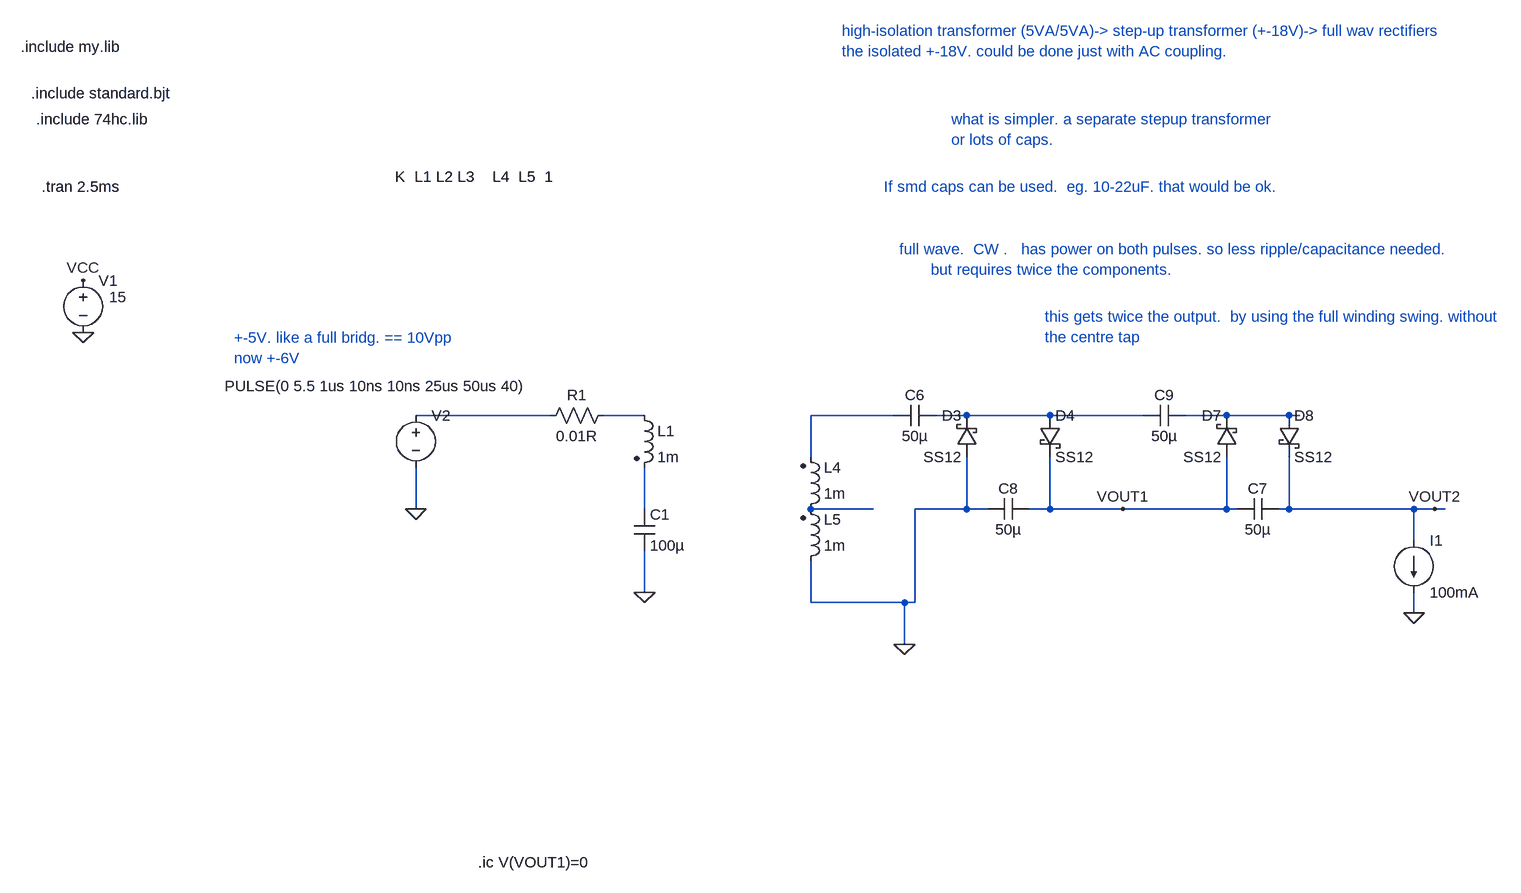
[diagram p0: schematic Draft105.asc]
Draft105.asc, the LTspice schematic file:
Version 4
SHEET 1 5720 1740
WIRE 1360 -128 1152 -128
WIRE 1504 -128 1440 -128
WIRE 1888 -128 1760 -128
WIRE 2000 -128 1952 -128
WIRE 2128 -128 2000 -128
WIRE 2272 -128 2128 -128
WIRE 2400 -128 2336 -128
WIRE 2496 -128 2400 -128
WIRE 2512 -128 2496 -128
WIRE 1760 -64 1760 -128
WIRE 1152 16 1152 -48
WIRE 1504 16 1504 -48
WIRE 1856 16 1760 16
WIRE 2000 16 2000 -64
WIRE 2000 16 1920 16
WIRE 2032 16 2000 16
WIRE 2128 16 2128 -64
WIRE 2128 16 2096 16
WIRE 2240 16 2128 16
WIRE 2400 16 2400 -64
WIRE 2400 16 2240 16
WIRE 2416 16 2400 16
WIRE 2496 16 2496 -64
WIRE 2496 16 2480 16
WIRE 2688 16 2496 16
WIRE 2720 16 2688 16
WIRE 2736 16 2720 16
WIRE 2688 64 2688 16
WIRE 1504 144 1504 80
WIRE 1760 160 1760 96
WIRE 1904 160 1760 160
WIRE 1920 160 1920 16
WIRE 1920 160 1904 160
WIRE 2688 176 2688 144
WIRE 1904 224 1904 160
FLAG 640 -256 0
FLAG 640 -336 VCC
FLAG 1504 144 0
FLAG 2240 16 VOUT1
FLAG 2720 16 VOUT2
FLAG 2688 176 0
FLAG 1152 16 0
FLAG 1904 224 0
SYMBOL ind2 1744 32 M180
WINDOW 0 36 80 Left 2
WINDOW 3 36 40 Left 2
SYMATTR InstName L4
SYMATTR Value 1m
SYMATTR Type ind
SYMBOL voltage 640 -352 R0
WINDOW 123 0 0 Left 0
WINDOW 39 0 0 Left 0
WINDOW 3 40 42 Left 2
SYMATTR Value 15
SYMATTR InstName V1
SYMBOL ind2 1488 -144 R0
SYMATTR InstName L1
SYMATTR Value 1m
SYMATTR Type ind
SYMBOL voltage 1152 -144 R0
WINDOW 123 0 0 Left 0
WINDOW 39 0 0 Left 0
WINDOW 3 -294 -29 Left 2
SYMATTR Value PULSE(0 5.5 1us 10ns 10ns 25us 50us 40)
SYMATTR InstName V2
SYMBOL ind2 1744 112 M180
WINDOW 0 36 80 Left 2
WINDOW 3 36 40 Left 2
SYMATTR InstName L5
SYMATTR Value 1m
SYMATTR Type ind
SYMBOL schottky 2016 -64 R180
WINDOW 0 24 64 Left 2
WINDOW 3 24 0 Left 2
SYMATTR InstName D3
SYMATTR Value SS12
SYMATTR Description Diode
SYMATTR Type diode
SYMBOL cap 1952 -144 R90
WINDOW 0 0 32 VBottom 2
WINDOW 3 32 32 VTop 2
SYMATTR InstName C6
SYMATTR Value 50µ
SYMBOL cap 2032 32 R270
WINDOW 0 32 32 VTop 2
WINDOW 3 0 32 VBottom 2
SYMATTR InstName C8
SYMATTR Value 50µ
SYMBOL cap 2416 32 R270
WINDOW 0 32 32 VTop 2
WINDOW 3 0 32 VBottom 2
SYMATTR InstName C7
SYMATTR Value 50µ
SYMBOL cap 2336 -144 R90
WINDOW 0 0 32 VBottom 2
WINDOW 3 32 32 VTop 2
SYMATTR InstName C9
SYMATTR Value 50µ
SYMBOL schottky 2112 -128 R0
SYMATTR InstName D4
SYMATTR Value SS12
SYMATTR Description Diode
SYMATTR Type diode
SYMBOL schottky 2416 -64 R180
WINDOW 0 24 64 Left 2
WINDOW 3 24 0 Left 2
SYMATTR InstName D7
SYMATTR Value SS12
SYMATTR Description Diode
SYMATTR Type diode
SYMBOL schottky 2480 -128 R0
SYMATTR InstName D8
SYMATTR Value SS12
SYMATTR Description Diode
SYMATTR Type diode
SYMBOL current 2688 64 R0
WINDOW 123 0 0 Left 0
WINDOW 39 0 0 Left 0
SYMATTR InstName I1
SYMATTR Value 100mA
SYMBOL cap 1488 16 R0
SYMATTR InstName C1
SYMATTR Value 100µ
SYMBOL res 1456 -144 R90
WINDOW 0 0 56 VBottom 2
WINDOW 3 32 56 VTop 2
SYMATTR InstName R1
SYMATTR Value 0.01R
TEXT 576 -480 Left 2 !.tran 2.5ms
TEXT 1120 -496 Left 2 !K  L1 L2 L3    L4  L5  1
TEXT 560 -624 Left 2 !.include standard.bjt
TEXT 544 -696 Left 2 !.include my.lib
TEXT 568 -584 Left 2 !.include 74hc.lib
TEXT 872 -248 Left 2 ;+-5V. like a full bridg. == 10Vpp\nnow +-6V
TEXT 1896 -384 Left 2 ;full wave.  CW .   has power on both pulses. so less ripple/capacitance needed.\n       but requires twice the components.
TEXT 1976 -584 Left 2 ;what is simpler. a separate stepup transformer\nor lots of caps.
TEXT 1808 -720 Left 2 ;high-isolation transformer (5VA/5VA)-> step-up transformer (+-18V)-> full wav rectifiers\nthe isolated +-18V. could be done just with AC coupling.
TEXT 1872 -480 Left 2 ;If smd caps can be used.  eg. 10-22uF. that would be ok.
TEXT 2120 -280 Left 2 ;this gets twice the output.  by using the full winding swing. without\nthe centre tap
TEXT 1248 560 Left 2 !.ic V(VOUT1)=0

The netlist it stands for:
* Draft105.asc
L4 N007 N003 1m
V1 VCC 0 15
L1 N002 N006 1m
V2 N001 0 PULSE(0 5.5 1us 10ns 10ns 25us 50us 40)
L5 0 N007 1m
D3 0 N004 SS12
C6 N004 N003 50µ
C8 0 VOUT1 50µ
C7 VOUT1 VOUT2 50µ
C9 N005 N004 50µ
D4 N004 VOUT1 SS12
D7 VOUT1 N005 SS12
D8 N005 VOUT2 SS12
I1 VOUT2 0 100mA
C1 N006 0 100µ
R1 N002 N001 0.01R
.model D D
.lib standard.dio
.tran 2.5ms
K  L1 L2 L3    L4  L5  1
.include standard.bjt
.include my.lib
.include 74hc.lib
* +-5V. like a full bridg. == 10Vpp
* now +-6V
* full wave.  CW .   has power on both pulses. so less ripple/capacitance needed.
*        but requires twice the components.
* what is simpler. a separate stepup transformer
* or lots of caps.
* high-isolation transformer (5VA/5VA)-> step-up transformer (+-18V)-> full wav rectifiers
* the isolated +-18V. could be done just with AC coupling.
* If smd caps can be used.  eg. 10-22uF. that would be ok.
* this gets twice the output.  by using the full winding swing. without
* the centre tap
.ic V(VOUT1)=0
.backanno
.end